# EasyEDA Pro project inverted_board2.eprj

# Schematic Schematic1
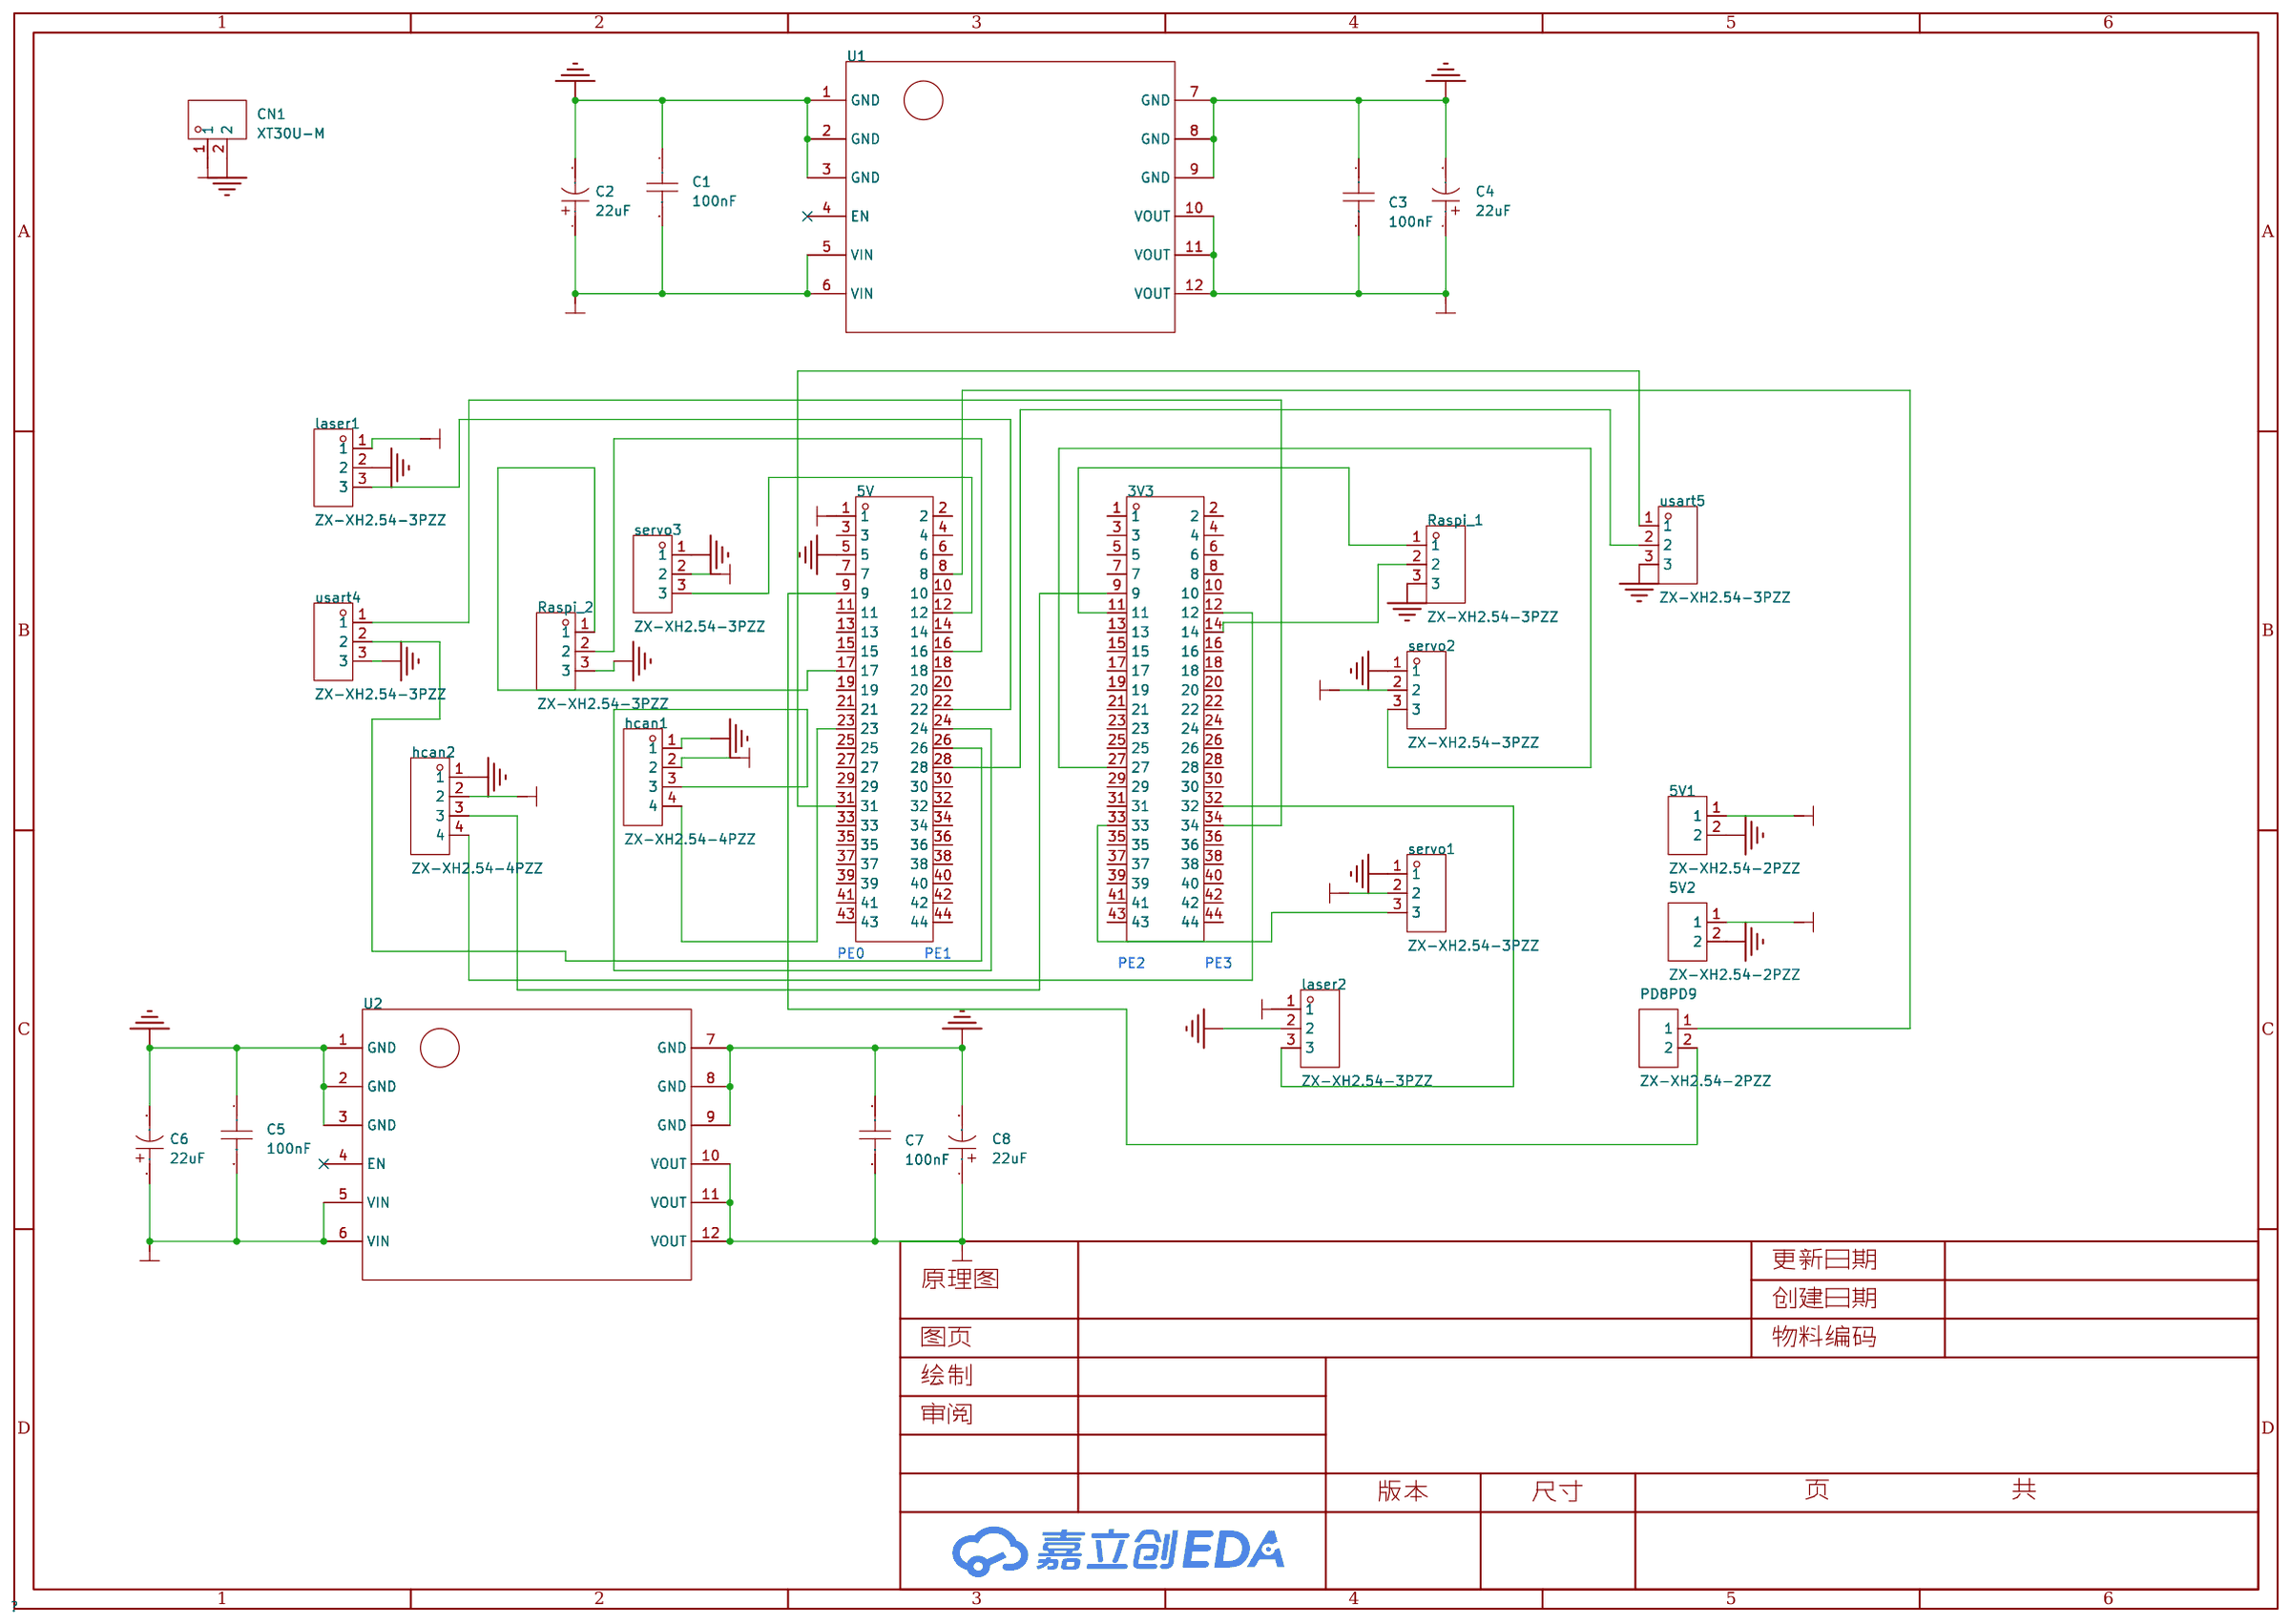
[diagram p0: schematic sheet]

## Parts
3V3  X6521FV-2x22-C85D32  [HDR-TH_44P-P2.54-V-F-R2-C22-S2.54]
5V  X6521FV-2x22-C85D32  [HDR-TH_44P-P2.54-V-F-R2-C22-S2.54]
5V1  ZX-XH2.54-2PZZ  [CONN-TH_2P-P2.50_HX25003-2A]
5V2  ZX-XH2.54-2PZZ  [CONN-TH_2P-P2.50_HX25003-2A]
C1  100nF  [C0603]
C2  22uF  [CAP-TH_BD8.0-P5.00-D0.6-FD]
C3  100nF  [C0603]
C4  22uF  [CAP-TH_BD8.0-P5.00-D0.6-FD]
C5  100nF  [C0603]
C6  22uF  [CAP-TH_BD8.0-P5.00-D0.6-FD]
C7  100nF  [C0603]
C8  22uF  [CAP-TH_BD8.0-P5.00-D0.6-FD]
CN1  XT30U-M  [CONN-TH_XT30U-M]
hcan1  ZX-XH2.54-4PZZ  [CONN-TH_4P-P2.50_4PIN]
hcan2  ZX-XH2.54-4PZZ  [CONN-TH_4P-P2.50_4PIN]
laser1  ZX-XH2.54-3PZZ  [CONN-TH_3P-P2.54_2501S-3P]
laser2  ZX-XH2.54-3PZZ  [CONN-TH_3P-P2.54_2501S-3P]
PD8PD9  ZX-XH2.54-2PZZ  [CONN-TH_2P-P2.50_HX25003-2A]
Raspi_1  ZX-XH2.54-3PZZ  [CONN-TH_3P-P2.54_2501S-3P]
Raspi_2  ZX-XH2.54-3PZZ  [CONN-TH_3P-P2.54_2501S-3P]
servo1  ZX-XH2.54-3PZZ  [CONN-TH_3P-P2.54_2501S-3P]
servo2  ZX-XH2.54-3PZZ  [CONN-TH_3P-P2.54_2501S-3P]
servo3  ZX-XH2.54-3PZZ  [CONN-TH_3P-P2.54_2501S-3P]
U1  -  [TPS5430]
U2  -  [TPS5430]
usart4  ZX-XH2.54-3PZZ  [CONN-TH_3P-P2.54_2501S-3P]
usart5  ZX-XH2.54-3PZZ  [CONN-TH_3P-P2.54_2501S-3P]

## Library data of the parts
3V3 5V = X6521FV-2x22-C85D32: LCSC Part Name: 间距:2.54mm 2x22P 直插; Supplier Part: C2883995; Manufacturer: XKB Connection(中国星坤); Supplier Footprint: 插件,P=2.54mm; JLCPCB Part Class: 扩展库; Datasheet: https://atta.szlcsc.com/upload/public/pdf/source/20211009/C636DBF0733662F7F428F4420CCBBD46.pdf; Supplier: LCSC; Holes Structure: 2x22P; Pitch: 2.54mm; Row Spacing: 2.54mm; Circular Hole / Square Hole: 方孔; Mounting Type: 直插; Number of Rows: 双排; Number of Holes: 44P; Current Rating (Max): 3A; Voltage Rating (Max): 250V; Holes Direction: 顶部; Insulation Height: 8.5mm; Contact Material: 黄铜; Contact Plating: 金; Operating Temperature Range: -40℃~+105℃; Soldering Temperature(Max): 260℃
5V1 5V2 PD8PD9 = ZX-XH2.54-2PZZ: LCSC Part Name: 1x2P 间距:2.5mm 直插 系列:XH; Supplier Part: C7429632; Manufacturer: Megastar(兆星); Supplier Footprint: 插件,P=2.5mm; JLCPCB Part Class: 扩展库; Datasheet: https://atta.szlcsc.com/upload/public/pdf/source/20230619/19BA6947230AA44A04D3EDD65E618FD0.pdf; Supplier: LCSC; Pins Structure: 1x2P; Pitch: 2.5mm; Mounting Type: 直插; Reference Series: XH; Number of Pins: 2P; Number of Rows: 1; Number of PINs Per Row: 2; Rated Current: 3A; Contact Material: 黄铜; Contact Plating: 锡; Operating Temperature: -25℃~+85℃; Rated Voltage (Max): 250V; Plastic Material: PA66; Flame Retardant Rating: UL94V-0; Color: 白色; Z-Height of the Board: 7mm; X-Length of Bottom Edge on Board (Spacing Line): 7.5mm; Y-Width of Bottom Edge on Board: 5.9mm
C1 C3 C5 C7 = CGA0603X7R104K500JT: LCSC Part Name: 100nF ±10% 50V; Supplier Part: C6119867; Manufacturer: HRE(芯声); Supplier Footprint: 0603; JLCPCB Part Class: 扩展库; Datasheet: https://atta.szlcsc.com/upload/public/pdf/source/20250103/C44077DA9E7B3EFAE02F22B6D3D1CBC9.pdf; Supplier: LCSC; Tolerance: ±10%; Voltage Rating: 50V; Temperature Coefficient: X7R
C2 C4 C6 C8 = CD110226M2G0816VFL: LCSC Part Name: 22uF 400V; Supplier Part: C7499973; Manufacturer: HRK(鸿瑞凯); Supplier Footprint: 插件,D8xL16mm; JLCPCB Part Class: 扩展库; Supplier: LCSC; Voltage Rated: 400V; Diameter: 8mm; Height - Seated (Max): 16mm
CN1 = XT30U-M: LCSC Part Name: AMASS(艾迈斯)轻量版锂电池插头公头 XT30U-M; Supplier Part: C99101; Manufacturer: AMASS(艾迈斯); JLCPCB Part Class: 扩展库; Datasheet: https://atta.szlcsc.com/upload/public/pdf/source/20170606/1496716542582.pdf; Supplier: LCSC; Brand: 艾迈斯; Type: 插头; Colour: 黄色; InterfaceType: 公头
hcan1 hcan2 = ZX-XH2.54-4PZZ: LCSC Part Name: 1x4P 间距:2.5mm 直插 系列:XH; Supplier Part: C7429634; Manufacturer: Megastar(兆星); Supplier Footprint: 插件,P=2.5mm; JLCPCB Part Class: 扩展库; Datasheet: https://atta.szlcsc.com/upload/public/pdf/source/20230619/B529A2163E0159A644AB3383D208FB03.pdf; Supplier: LCSC; Pins Structure: 1x4P; Pitch: 2.5mm; Mounting Type: 直插; Reference Series: XH; Number of Pins: 4P; Number of Rows: 1; Number of PINs Per Row: 4; Rated Current: 3A; Contact Material: 黄铜; Contact Plating: 锡; Operating Temperature: -25℃~+85℃; Rated Voltage (Max): 250V; Plastic Material: PA66; Flame Retardant Rating: UL94V-0; Color: 白色; Z-Height of the Board: 7mm; X-Length of Bottom Edge on Board (Spacing Line): 12.5mm; Y-Width of Bottom Edge on Board: 5.9mm
laser1 laser2 Raspi_1 Raspi_2 servo1-servo3 usart4 usart5 = ZX-XH2.54-3PZZ: LCSC Part Name: 1x3P 间距:2.5mm 直插 系列:XH; Supplier Part: C7429633; Manufacturer: Megastar(兆星); Supplier Footprint: 插件,P=2.5mm; JLCPCB Part Class: 扩展库; Datasheet: https://atta.szlcsc.com/upload/public/pdf/source/20230619/AE17037A2CFDBE8D9CBA775D61AD0A84.pdf; Supplier: LCSC; Pins Structure: 1x3P; Pitch: 2.5mm; Mounting Type: 直插; Reference Series: XH; Number of Pins: 3P; Number of Rows: 1; Number of PINs Per Row: 3; Rated Current: 3A; Contact Material: 黄铜; Contact Plating: 锡; Operating Temperature: -25℃~+85℃; Rated Voltage (Max): 250V; Plastic Material: PA66; Flame Retardant Rating: UL94V-0; Color: 白色; Z-Height of the Board: 7mm; X-Length of Bottom Edge on Board (Spacing Line): 10mm; Y-Width of Bottom Edge on Board: 5.9mm
U1 U2 = 12V-5V

## Nets
GND: 5V.5 5V1.2 5V2.2 C1.1 C2.2 C3.1 C4.2 C5.1 C6.2 C7.1 C8.2 CN1.2 hcan1.1 hcan2.1 laser1.2 laser2.2 Raspi_1.3 Raspi_2.3 servo1.1 servo2.1 servo3.1 U1.1(GND) U1.2(GND) U1.3(GND) U1.7(GND) U1.8(GND) U1.9(GND) U2.1(GND) U2.2(GND) U2.3(GND) U2.7(GND) U2.8(GND) U2.9(GND) usart4.3 usart5.3
VIN: C1.2 C2.1 C5.2 C6.1 CN1.1 U1.5(VIN) U1.6(VIN) U2.5(VIN) U2.6(VIN)
VOUT_H: C3.2 C4.1 servo1.2 servo2.2 servo3.2 U1.10(VOUT) U1.11(VOUT) U1.12(VOUT)
VOUT_L: 5V.1 5V1.1 5V2.1 C7.2 C8.1 hcan1.2 hcan2.2 laser1.1 laser2.1 U2.10(VOUT) U2.11(VOUT) U2.12(VOUT)
$1N1101: 3V3.33 servo1.3
$1N1110: 3V3.27 servo2.3
$1N3348: 3V3.11 Raspi_1.1
$1N3403: 5V.17 Raspi_2.1
$1N8114: 5V.24 hcan1.3
$1N8149: 5V.23 hcan1.4
$1N8238: 3V3.14 Raspi_1.2
$1N8269: 3V3.32 laser2.3
$1N8276: 5V.12 servo3.3
$1N8294: 5V.16 Raspi_2.2
$1N10314: 5V.22 laser1.3
$1N11426: 3V3.9 hcan2.3
$1N11437: 3V3.12 hcan2.4
$1N11541: 5V.26 usart4.2
$1N11558: 3V3.34 usart4.1
$1N11697: 5V.31 usart5.1
$1N11708: 5V.28 usart5.2
Net-(5V-8): 5V.8 PD8PD9.1
Net-(5V-9): 5V.9 PD8PD9.2

Not connected (* = marked no-connect by the designer): 3V3 1 2 3 4 5 6 7 8 10 13 15 16 17 18 19 20 21 22 23 24 25 26 28 29 30 31 35 36 37 38 39 40 41 42 43 44; 5V 2 3 4 6 7 10 11 13 14 15 18 19 20 21 25 27 29 30 32 33 34 35 36 37 38 39 40 41 42 43 44; U1 4(EN)*; U2 4(EN)*

## Notes on the sheet
- PE0
- PE1
- PE2
- PE3

# Board PCB1
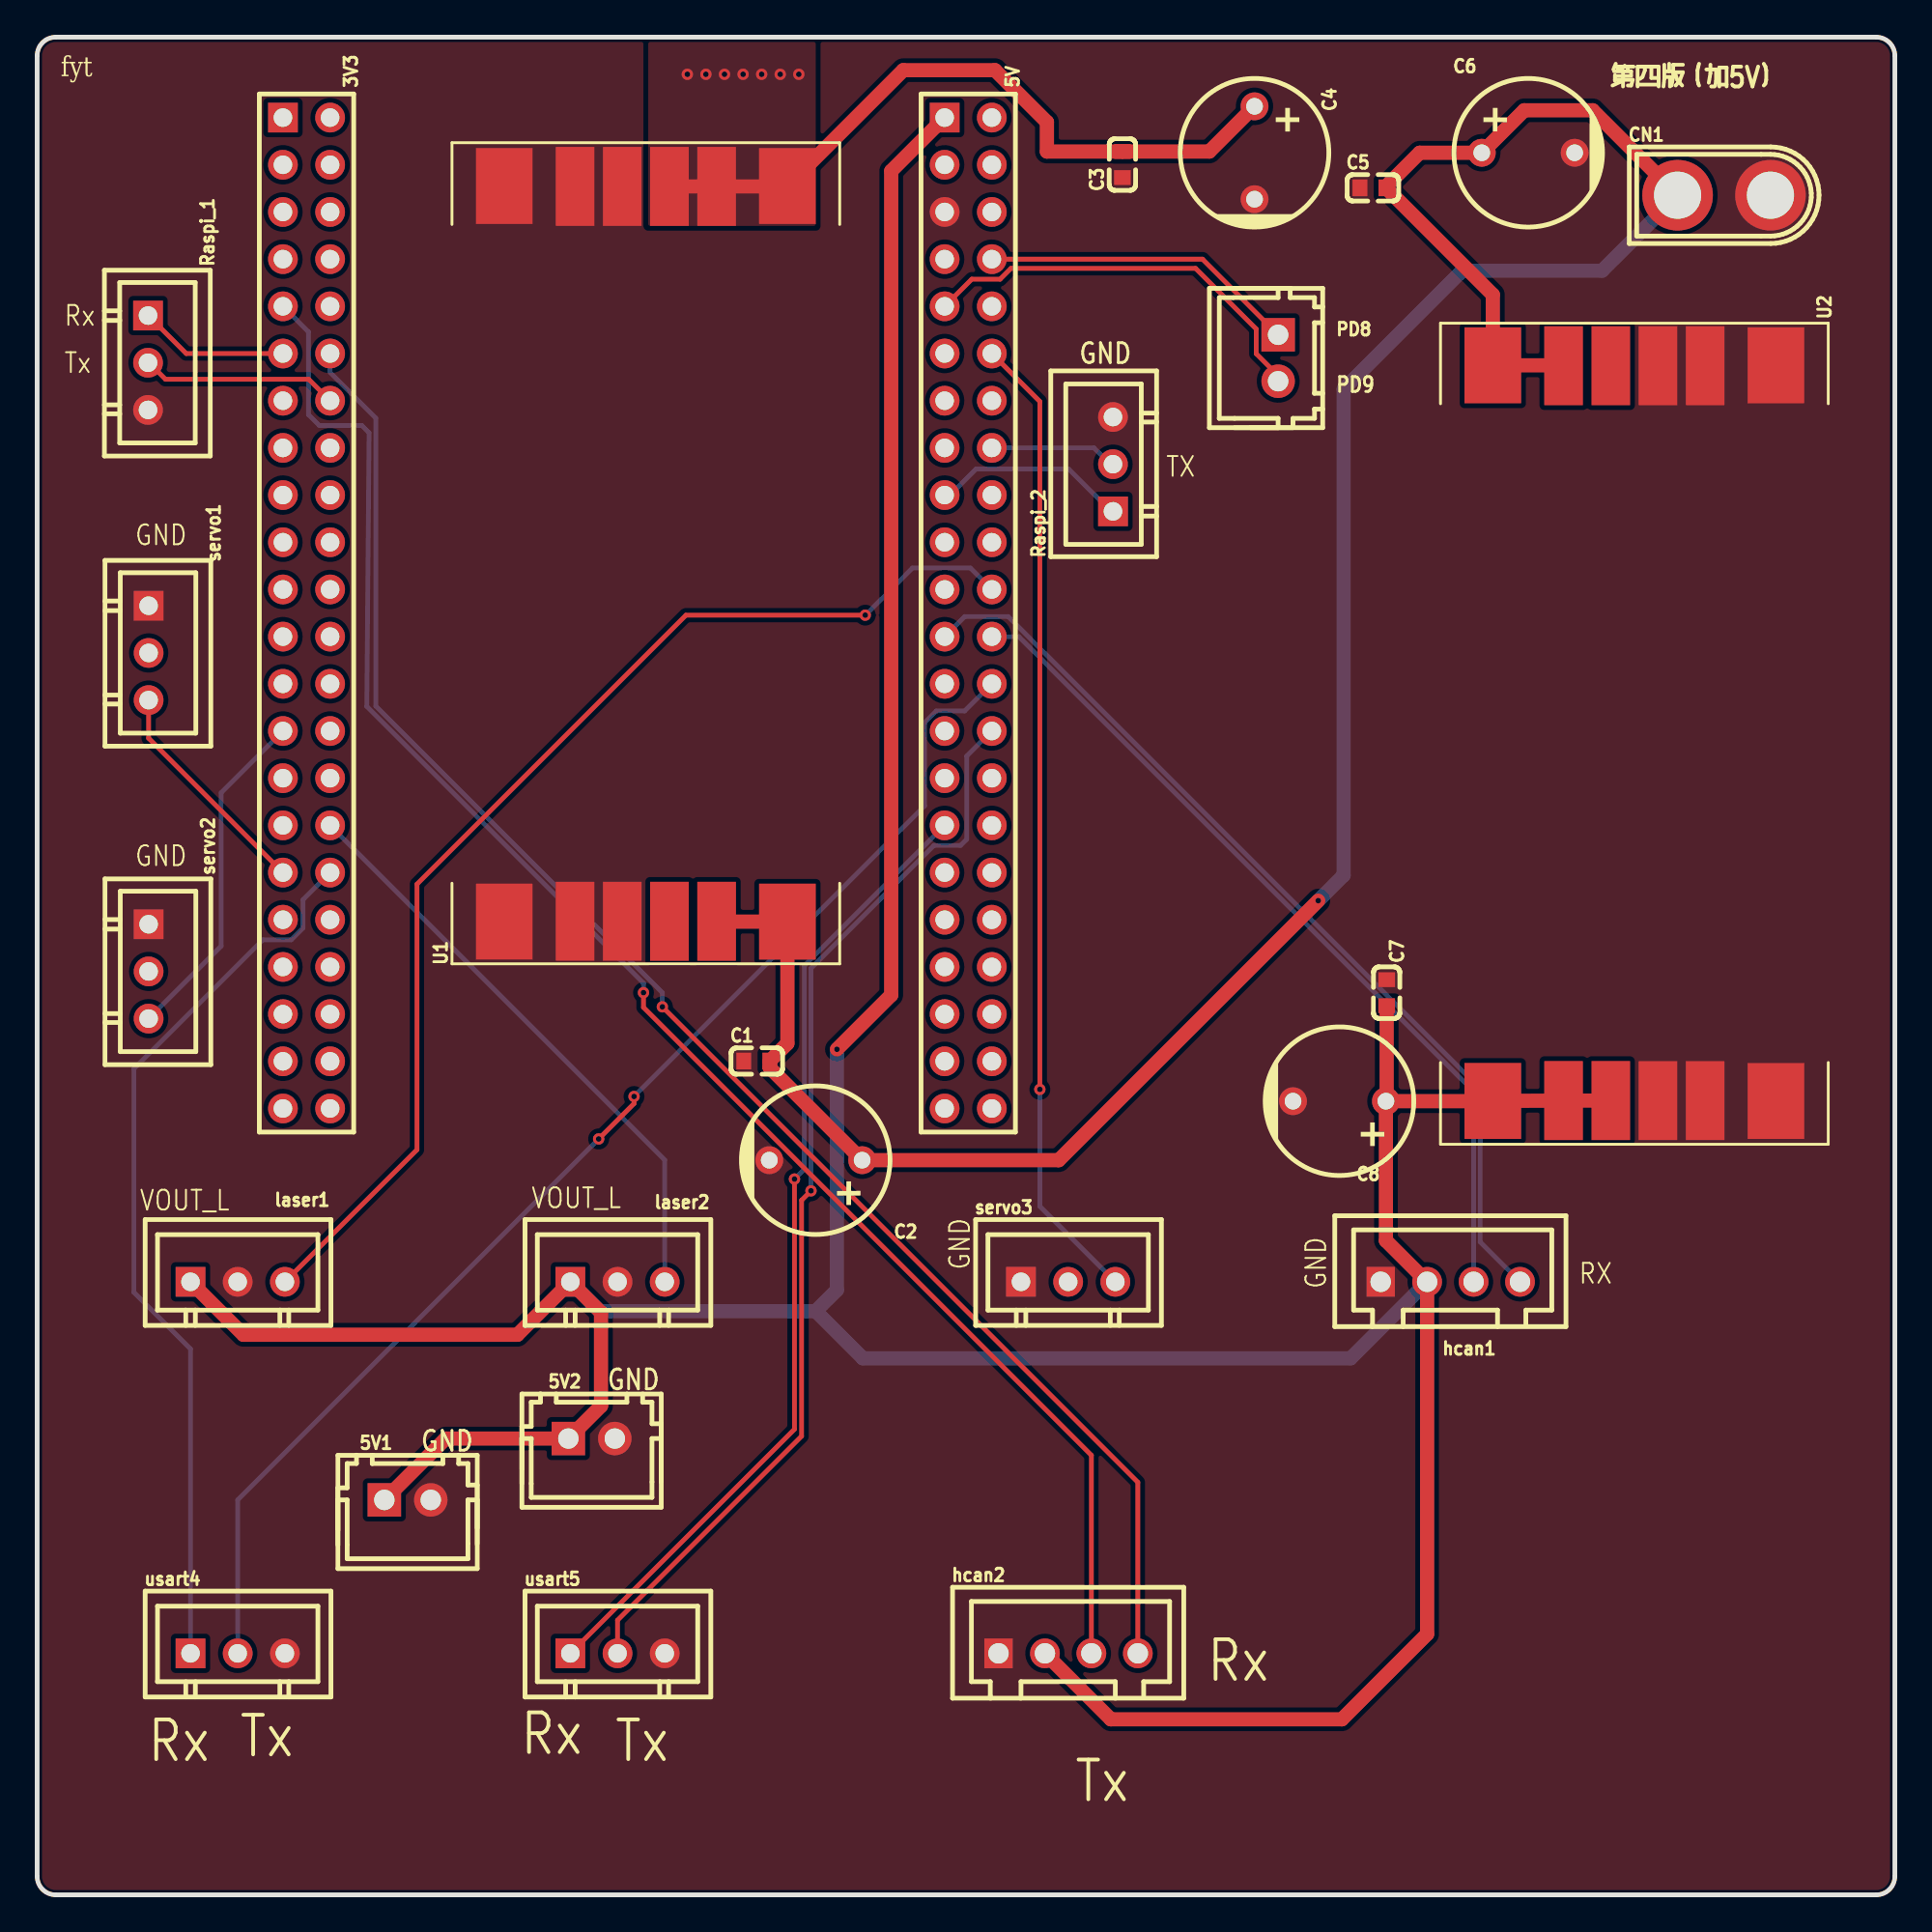
[diagram p1: board, top side]
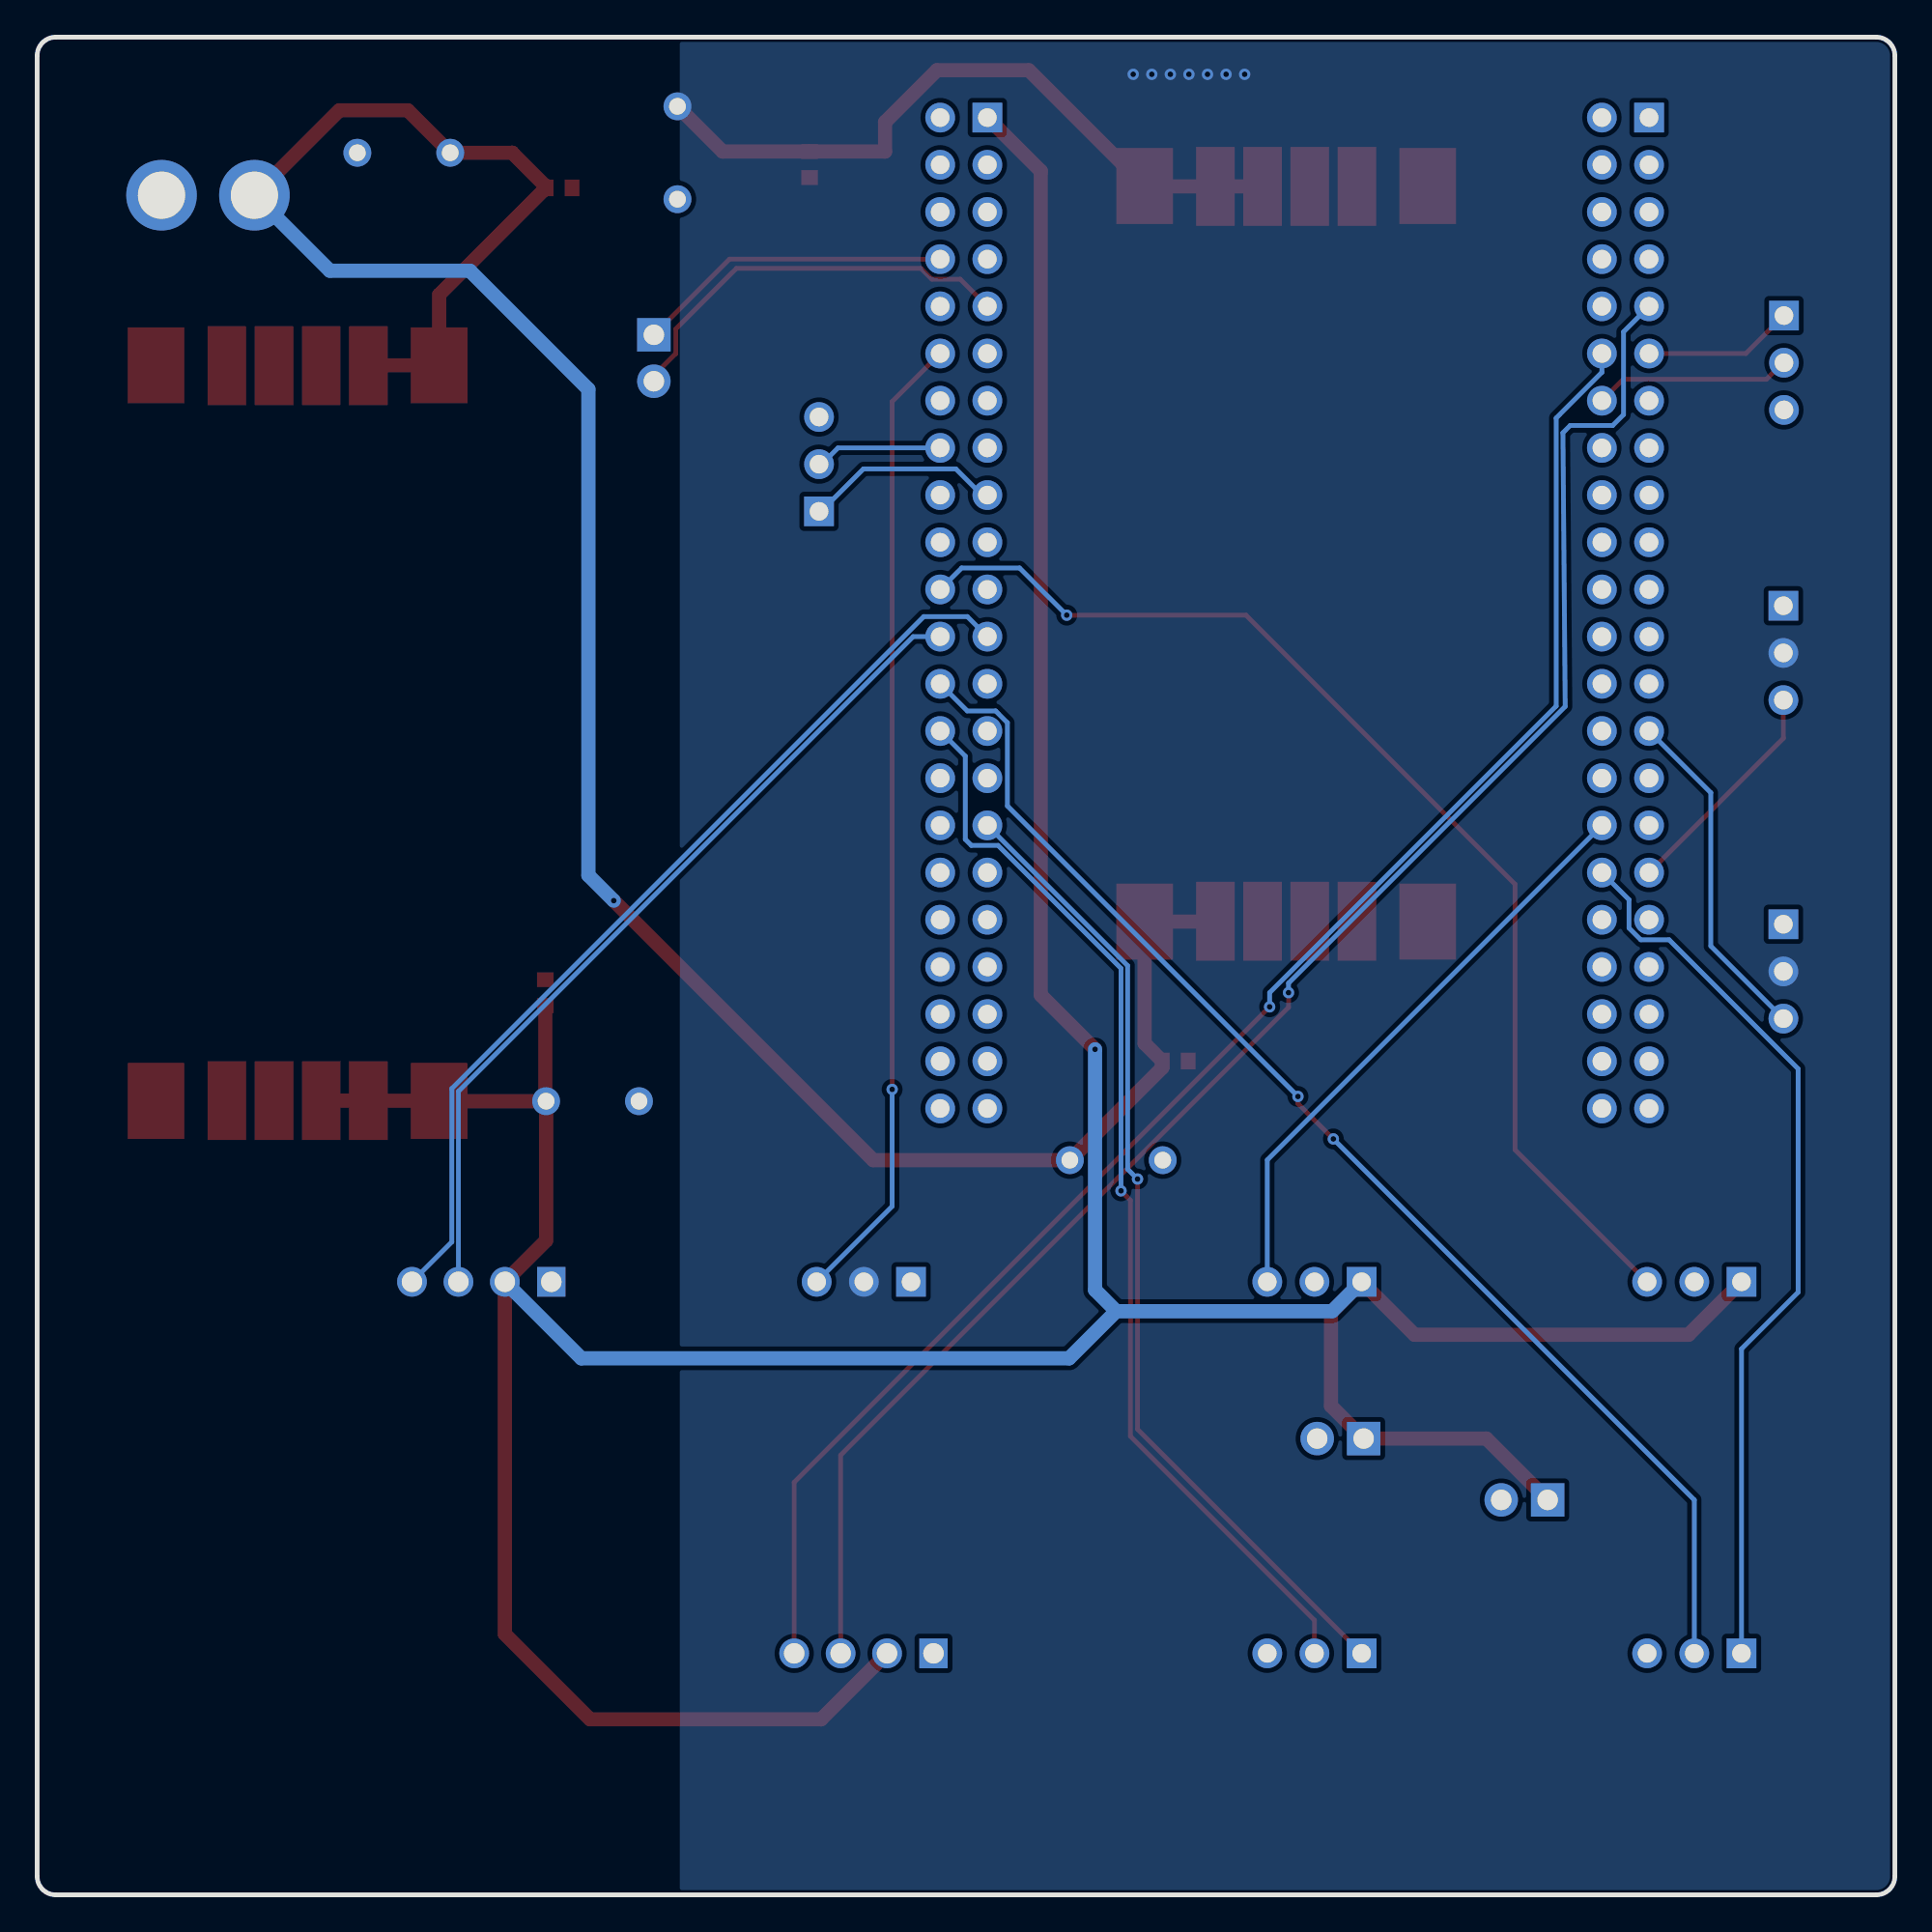
[diagram p2: board, bottom side, seen from below]

Outline 100 x 100 mm; copper layers: Top Layer, Bottom Layer. Coordinates in mm from the lower left corner of the outline.
Outline path: 0,99 0,1 arc(0.29,0.29) 1,0 99,0 arc(99.71,0.29) 100,1 100,99 arc(99.71,99.71) 99,100 1,100 arc(0.29,99.71) 0,99
Stack: Top Layer 0.035mm / Dielectric1 1.51mm FR4 er 4.5 / Bottom Layer 0.035mm

## Design rules (mm)
template: 自定义配置
spacing copperThickness1oz (default): track to track 0.102, other pairs 0.152 to 0.3
spacing copperThickness2oz: track to track 0.203, other pairs 0.152 to 0.3
track width copperThickness1oz (default): min 0.127, default 0.254, max 2.54
track width copperThickness2oz: min 0.203, default 0.254, max 2.54
differential pair differentialPair (default): width min 0.127, default 0.254, max 2.54; gap min 0.152, default 0.152
via viaSize (default): diameter min 0.5, default 0.61, max 10; hole min 0.3, default 0.305, max 6.3

## Placement (name value [footprint] x y rotation side)
3V3  X6521FV-2x22-C85D32  [HDR-TH_44P-P2.54-V-F-R2-C22-S2.54]  14.5 69 270 top
5V  X6521FV-2x22-C85D32  [HDR-TH_44P-P2.54-V-F-R2-C22-S2.54]  50.12 69 270 top
5V1  ZX-XH2.54-2PZZ  [CONN-TH_2P-P2.50_HX25003-2A]  19.94 21.26 0 top
5V2  ZX-XH2.54-2PZZ  [CONN-TH_2P-P2.50_HX25003-2A]  29.84 24.56 0 top
C1  100nF  [C0603]  38.74 44.89 0 top
C2  22uF  [CAP-TH_BD8.0-P5.00-D0.6-FD]  41.91 39.55 180 top
C3  100nF  [C0603]  58.42 93.14 90 top
C4  22uF  [CAP-TH_BD8.0-P5.00-D0.6-FD]  65.53 93.78 270 top
C5  100nF  [C0603]  71.91 91.89 0 top
C6  22uF  [CAP-TH_BD8.0-P5.00-D0.6-FD]  80.26 93.78 0 top
C7  100nF  [C0603]  72.64 48.56 270 top
C8  22uF  [CAP-TH_BD8.0-P5.00-D0.6-FD]  70.1 42.72 180 top
CN1  XT30U-M  [CONN-TH_XT30U-M]  90.81 91.49 0 top
hcan1  ZX-XH2.54-4PZZ  [CONN-TH_4P-P2.50_4PIN]  76.07 33 0 top
hcan2  ZX-XH2.54-4PZZ  [CONN-TH_4P-P2.50_4PIN]  55.5 13 0 top
laser1  ZX-XH2.54-3PZZ  [CONN-TH_3P-P2.54_2501S-3P]  10.8 33 0 top
laser2  ZX-XH2.54-3PZZ  [CONN-TH_3P-P2.54_2501S-3P]  31.24 33 0 top
PD8  ZX-XH2.54-2PZZ  [CONN-TH_2P-P2.50_HX25003-2A]  66.8 82.73 270 top
Raspi_1  ZX-XH2.54-3PZZ  [CONN-TH_3P-P2.54_2501S-3P]  5.97 82.47 270 top
Raspi_2  ZX-XH2.54-3PZZ  [CONN-TH_3P-P2.54_2501S-3P]  57.91 77.01 90 top
servo1  ZX-XH2.54-3PZZ  [CONN-TH_3P-P2.54_2501S-3P]  6 66.85 270 top
servo2  ZX-XH2.54-3PZZ  [CONN-TH_3P-P2.54_2501S-3P]  6 49.71 270 top
servo3  ZX-XH2.54-3PZZ  [CONN-TH_3P-P2.54_2501S-3P]  55.5 33 0 top
U1  -  [TPS5430]  32.77 72.19 90 top
U2  -  [TPS5430]  85.98 62.53 270 top
usart4  ZX-XH2.54-3PZZ  [CONN-TH_3P-P2.54_2501S-3P]  10.8 13 0 top
usart5  ZX-XH2.54-3PZZ  [CONN-TH_3P-P2.54_2501S-3P]  31.24 13 0 top

## Footprints (pads in the part's own frame, mm; a bottom-side part is the same pattern mirrored in y, then rotated)
C0603
  rect 0.8x0.9 smd: 1(-0.7,0) 2(0.7,0)
CAP-TH_BD8.0-P5.00-D0.6-FD
  round 1.5 hole 0.9: 1(-2.5,0) 2(2.5,0)
CONN-TH_2P-P2.50_HX25003-2A
  rect 1.8x1.8 hole 1.1: 1(-1.25,0)
  round 1.8 hole 1.1: 2(1.25,0)
CONN-TH_3P-P2.54_2501S-3P
  rect 1.6x1.6 hole 1: 1(-2.54,0)
  round 1.6 hole 1: 2(0,0) 3(2.54,0)
CONN-TH_4P-P2.50_4PIN
  rect 1.524x1.6 hole 1.1: 1(-3.75,0)
  round 1.6 hole 1.1: 2(-1.25,0) 3(1.25,0) 4(3.75,0)
CONN-TH_XT30U-M
  round 3.8 hole 2.54: 1(-2.5,0) 2(2.5,0)
HDR-TH_44P-P2.54-V-F-R2-C22-S2.54
  rect 1.6x1.6 hole 1: 1(-26.67,-1.27)
  round 1.6 hole 1: 2(-26.67,1.27) 3(-24.13,-1.27) 4(-24.13,1.27) 5(-21.59,-1.27) 6(-21.59,1.27) 7(-19.05,-1.27) 8(-19.05,1.27) 9(-16.51,-1.27) 10(-16.51,1.27) 11(-13.97,-1.27) 12(-13.97,1.27) 13(-11.43,-1.27) 14(-11.43,1.27) 15(-8.89,-1.27) 16(-8.89,1.27) 17(-6.35,-1.27) 18(-6.35,1.27) 19(-3.81,-1.27) 20(-3.81,1.27) 21(-1.27,-1.27) 22(-1.27,1.27) 23(1.27,-1.27) 24(1.27,1.27) 25(3.81,-1.27) 26(3.81,1.27) 27(6.35,-1.27) 28(6.35,1.27) 29(8.89,-1.27) 30(8.89,1.27) 31(11.43,-1.27) 32(11.43,1.27) 33(13.97,-1.27) 34(13.97,1.27) 35(16.51,-1.27) 36(16.51,1.27) 37(19.05,-1.27) 38(19.05,1.27) 39(21.59,-1.27) 40(21.59,1.27) 41(24.13,-1.27) 42(24.13,1.27) 43(26.67,-1.27) 44(26.67,1.27)
TPS5430
  rect 4.089x3.05 smd: 1(-19.799,7.62) 6(-19.799,-7.62) 7(19.799,7.62) 12(19.799,-7.62)
  rect 4.249x2.08 smd: 2(-19.779,3.81) 3(-19.779,1.27) 4(-19.779,-1.27) 5(-19.779,-3.81) 8(19.779,3.81) 9(19.779,1.27) 10(19.779,-1.27) 11(19.779,-3.81)

## Nets
As in the schematic, except:
$1N12947: 5V.8 PD8.1
$1N12982: 5V.9 PD8.2

Pads without a net: 3V3 1 2 3 4 5 6 7 8 10 13 15 16 17 18 19 20 21 22 23 24 25 26 28 29 30 31 35 36 37 38 39 40 41 42 43 44; 5V 2 3 4 6 7 10 11 13 14 15 18 19 20 21 25 27 29 30 32 33 34 35 36 37 38 39 40 41 42 43 44; U1 4; U2 4

## Via types
v1: diameter 0.61, hole 0.305, Top Layer to Bottom Layer, 17 vias

## Routing (per net, layer and track width the routed paths; a pad name or vN(x,y) marks a point on that pad's centre or on a via; arc(x,y) is an arc through that point)
GND: length 0.1
  Top Layer w0.762: 10.8,33.07 laser1.2
VIN: length 135
  Top Layer w0.762: v1(68.96,53.52) 54.99,39.55 C2.1 39.44,44.52 C1.2 40.39,45.83 U1.6 36.6,52.39 U1.5 ; CN1.1 83.73,96.06 80.05,96.06 C6.1 74.42,93.78 72.6,91.96 C5.2 78.36,86.14 U2.6 82.15,82.33 U2.5
  Bottom Layer w0.762: CN1.1 84.24,87.43 76.71,87.43 70.33,81.05 70.33,54.88 v1(68.96,53.52)
VOUT_H: length 37.8
  Top Layer w0.762: U1.10 U1.11 40.37,91.97 U1.12 46.62,98.22 51.56,98.22 54.36,95.43 54.36,93.84 C3.2 63.1,93.84 C4.1
  vias: v1(35,98) v1(36,98) v1(37,98) v1(38,98) v1(39,98) v1(40,98) v1(41,98)
VOUT_L: length 231.4
  Top Layer w0.762: v1(43.05,45.52) 45.97,48.44 45.97,92.79 5V.1 ; U2.10 U2.11 U2.12 78.35,42.72 C8.1 ; C8.1 72.6,35.22 hcan1.2 74.82,14.04 70.23,9.45 57.8,9.45 hcan2.2 ; C8.1 72.64,42.76 C7.2 ; 5V1.1 21.99,24.56 5V2.1 30.35,26.32 30.35,31.35 laser2.1 25.85,30.15 11.11,30.15 laser1.1
  Bottom Layer w0.762: laser2.1 30.28,31.42 41.91,31.42 ; 41.91,31.42 43.05,32.56 v1(43.05,45.52) ; 41.91,31.42 44.45,28.88 70.7,28.88 hcan1.2
$1N1101: length 12.3
  Top Layer w0.254: 3V3.33 6,62.26 servo1.3
$1N1110: length 18.5
  Bottom Layer w0.254: servo2.3 9.91,51.07 9.91,59.33 3V3.27
$1N3348: length 8.1
  Top Layer w0.254: 6,84.99 8.02,82.97 3V3.11
$1N3403: length 10.6
  Bottom Layer w0.254: 5V.17 49.14,75.35 50.55,76.76 55.52,76.76 57.91,74.37
$1N8114: length 46.3
  Bottom Layer w0.254: 5V.24 52.84,67.73 77.32,43.25 hcan1.3
$1N8149: length 51.1
  Bottom Layer w0.254: 5V.23 49.93,68.81 52.27,68.81 77.68,43.4 77.68,35.14 hcan1.4
$1N8238: length 10.6
  Top Layer w0.254: 3V3.14 14.61,81.58 6.91,81.58 6,82.49
$1N8269: length 32
  Bottom Layer w0.254: laser2.3 33.78,39.56 3V3.32
$1N8276: length 52.7
  Top Layer w0.254: 5V.12 53.97,80.39 v1(53.97,43.36)
  Bottom Layer w0.254: v1(53.97,43.36) 53.97,37.06 servo3.3
$1N8294: length 6.9
  Bottom Layer w0.254: 57.91,76.87 56.89,77.89 5V.16
$1N10314: length 62.8
  Top Layer w0.254: laser1.3 20.45,40.11 20.45,54.41 34.93,68.89 v1(44.58,68.89)
  Bottom Layer w0.254: v1(44.58,68.89) 47.12,71.42 50.24,71.42 5V.22
$1N11426: length 91.9
  Top Layer w0.254: v1(32.64,48.56) 32.64,47.77 56.75,23.66 hcan2.3
  Bottom Layer w0.254: 3V3.9 14.61,84.14 14.61,79.68 15.19,79.1 17.47,79.1 17.87,78.7 17.75,63.97 32.64,49.08 v1(32.64,48.56)
$1N11437: length 88
  Top Layer w0.254: v1(33.66,47.8) 59.25,22.21 hcan2.4
  Bottom Layer w0.254: 3V3.12 15.77,81.96 18.23,79.5 18.23,63.99 33.66,48.56 v1(33.66,47.8)
$1N11541: length 69.9
  Top Layer w0.254: v1(32.13,42.98) 32.13,42.6 v1(30.23,40.69)
  Bottom Layer w0.254: v1(32.13,42.98) 47.77,58.62 47.77,63.1 48.4,63.73 49.93,63.73 5V.26 ; v1(30.23,40.69) 10.8,21.26 usart4.2
$1N11558: length 48.6
  Bottom Layer w0.254: usart4.1 8.25,29.39 5.21,32.44 5.21,44.47 12.15,51.41 13.68,51.41 14.31,52.04 14.31,53.57 3V3.34
$1N11697: length 52.9
  Top Layer w0.254: usart5.1 40.77,25.06 v1(40.77,38.53)
  Bottom Layer w0.254: 5V.31 41.3,50.02 41.3,39.06 v1(40.77,38.53)
$1N11708: length 58.8
  Top Layer w0.254: v1(41.66,37.9) 41.15,37.39 41.15,24.69 31.24,14.78 usart5.2
  Bottom Layer w0.254: 5V.28 50.04,61.3 50.04,56.82 49.71,56.49 48.27,56.49 41.66,49.87 v1(41.66,37.9)
$1N12947: length 17.1
  Top Layer w0.254: PD8.1 62.73,88.05 5V.8
$1N12982: length 22.3
  Top Layer w0.254: PD8.2 66.8,81.78 65.62,82.96 65.62,84.29 62.36,87.55 52.42,87.55 51.84,86.97 50.31,86.97 5V.9

## Copper pours and planes (outline as drawn; the poured copper is in the pictures)
GND on Top Layer: -20.07,110.92 122.05,110.92 122.05,-11.38 -20.07,-11.38
VOUT_H on Top Layer: 32.89,102.54 41.91,102.54 41.91,89.84 32.89,89.84
VOUT_H on Bottom Layer: -3.81,101.14 65.41,101.14 65.41,-3.12 -3.81,-3.12

## Text on the board
Top Silkscreen Layer: PD9 | Rx | Tx | GND | VOUT_L | TX | RX | 第四版（加5V） | fyt
